# EAGLE design GAT8 PCB (EAGLE 6.1)

## Sheet 1 of 3
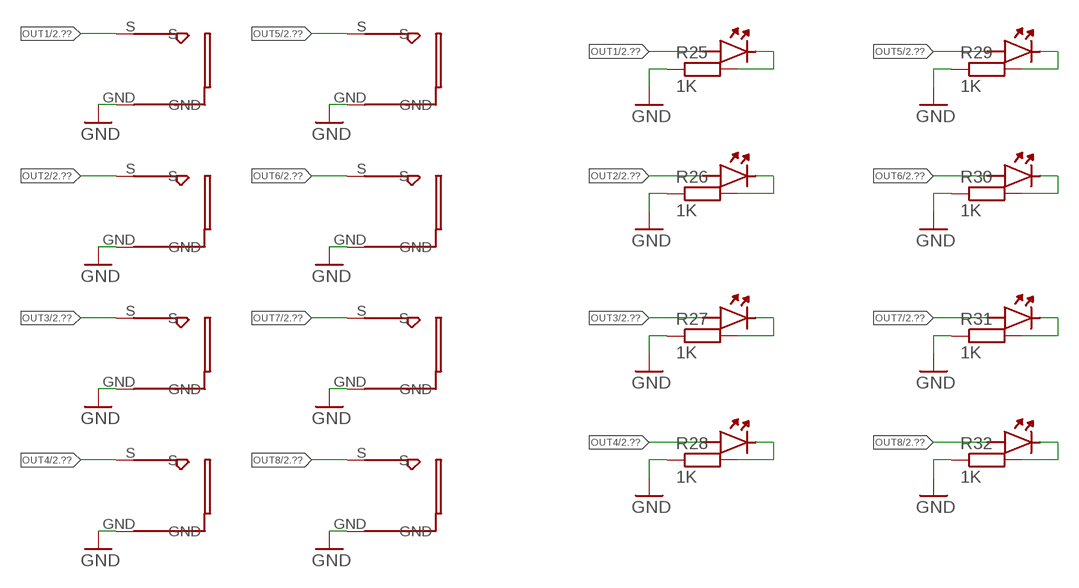
[diagram p0: schematic, sheet 1]

### Parts
LED8  LED  [LED]
OUT1  PJ302M  [PJ302M]
OUT2  PJ302M  [PJ302M]
OUT3  PJ302M  [PJ302M]
OUT4  PJ302M  [PJ302M]
OUT5  PJ302M  [PJ302M]
OUT6  PJ302M  [PJ302M]
OUT7  PJ302M  [PJ302M]
OUT8  PJ302M  [PJ302M]
R25  1K  R-EU_R1206  [R1206]
R26  1K  R-EU_R1206  [R1206]
R27  1K  R-EU_R1206  [R1206]
R28  1K  R-EU_R1206  [R1206]
R29  1K  R-EU_R1206  [R1206]
R30  1K  R-EU_R1206  [R1206]
R31  1K  R-EU_R1206  [R1206]
R32  1K  R-EU_R1206  [R1206]
U$1  LED  [LED]
U$2  LED  [LED]
U$3  LED  [LED]
U$4  LED  [LED]
U$5  LED  [LED]
U$6  LED  [LED]
U$7  LED  [LED]

### Nets
GND: OUT1.GND OUT2.GND OUT3.GND OUT4.GND OUT5.GND OUT6.GND OUT7.GND OUT8.GND R25.1 R26.1 R27.1 R28.1 R29.1 R30.1 R31.1 R32.1 ; also sheet 2,3
N$2: R26.2 U$2.GND
N$12: R25.2 U$1.GND
N$13: R27.2 U$3.GND
N$14: R28.2 U$4.GND
N$15: LED8.GND R32.2
N$16: R31.2 U$7.GND
N$17: R30.2 U$6.GND
N$18: R29.2 U$5.GND
OUT1: OUT1.S U$1.S ; also sheet 2
OUT2: OUT2.S U$2.S ; also sheet 2
OUT3: OUT3.S U$3.S ; also sheet 2
OUT4: OUT4.S U$4.S ; also sheet 2
OUT5: OUT5.S U$5.S ; also sheet 2
OUT6: OUT6.S U$6.S ; also sheet 2
OUT7: OUT7.S U$7.S ; also sheet 2
OUT8: LED8.S OUT8.S ; also sheet 2

## Sheet 2 of 3
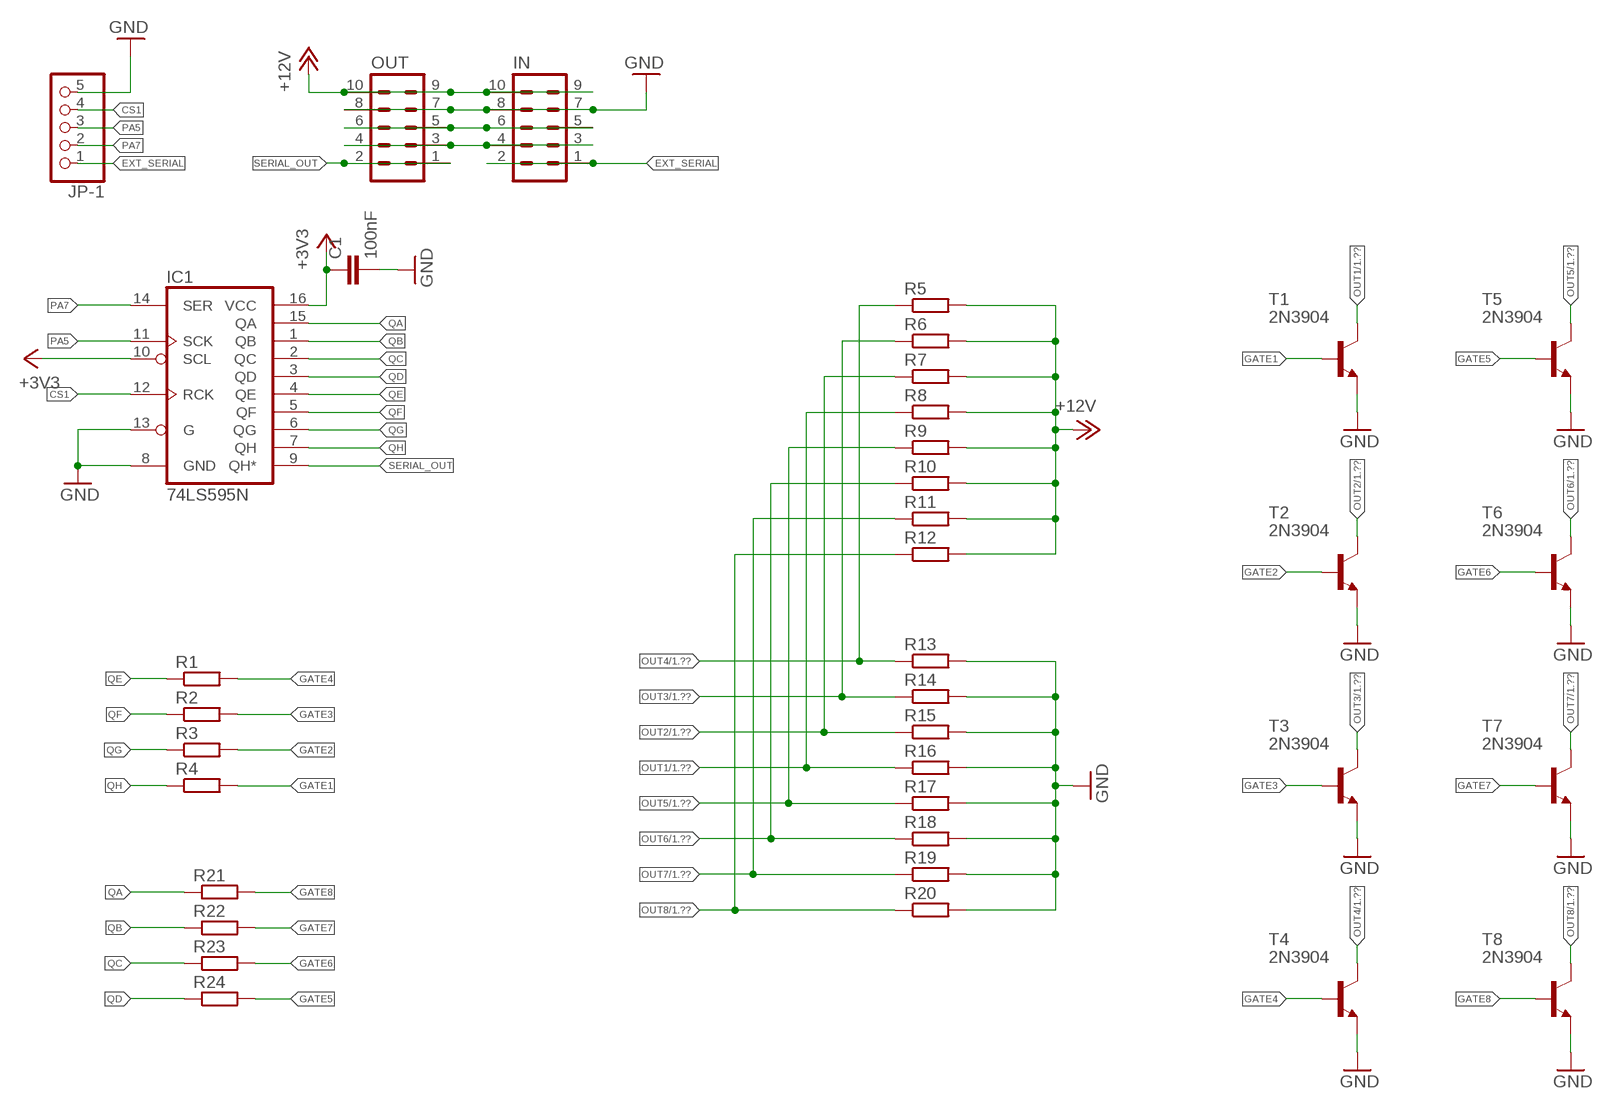
[diagram p1: schematic, sheet 2]

### Parts
C1  100nF  C-EUC1206K  [C1206K]
IC1  74LS595N  [DIL16]
IN  ML10  [ML10]
JP-1  PINHD-1X5_2.54  [1X05]
OUT  ML10  [ML10]
R1  R-EU_R1206  [R1206]
R2  R-EU_R1206  [R1206]
R3  R-EU_R1206  [R1206]
R4  R-EU_R1206  [R1206]
R5  R-EU_R1206  [R1206]
R6  R-EU_R1206  [R1206]
R7  R-EU_R1206  [R1206]
R8  R-EU_R1206  [R1206]
R9  R-EU_R1206  [R1206]
R10  R-EU_R1206  [R1206]
R11  R-EU_R1206  [R1206]
R12  R-EU_R1206  [R1206]
R13  R-EU_R1206  [R1206]
R14  R-EU_R1206  [R1206]
R15  R-EU_R1206  [R1206]
R16  R-EU_R1206  [R1206]
R17  R-EU_R1206  [R1206]
R18  R-EU_R1206  [R1206]
R19  R-EU_R1206  [R1206]
R20  R-EU_R1206  [R1206]
R21  R-EU_R1206  [R1206]
R22  R-EU_R1206  [R1206]
R23  R-EU_R1206  [R1206]
R24  R-EU_R1206  [R1206]
T1  2N3904  [TO92]
T2  2N3904  [TO92]
T3  2N3904  [TO92]
T4  2N3904  [TO92]
T5  2N3904  [TO92]
T6  2N3904  [TO92]
T7  2N3904  [TO92]
T8  2N3904  [TO92]

### Nets
+3V3: C1.1 IC1.10(SCL) IC1.16(VCC) ; also sheet 3
+12V: IN.9 IN.10 OUT.9 OUT.10 R5.2 R6.2 R7.2 R8.2 R9.2 R10.2 R11.2 R12.2 ; also sheet 3
CS1: IC1.12(RCK) JP-1.4
EXT_SERIAL: IN.1 IN.2 JP-1.1
GATE1: R4.2 T1.2(B)
GATE2: R3.2 T2.2(B)
GATE3: R2.2 T3.2(B)
GATE4: R1.2 T4.2(B)
GATE5: R24.2 T5.2(B)
GATE6: R23.2 T6.2(B)
GATE7: R22.2 T7.2(B)
GATE8: R21.2 T8.2(B)
GND: C1.2 IC1.8(GND) IC1.13(G) IN.7 IN.8 JP-1.5 OUT.7 OUT.8 R13.2 R14.2 R15.2 R16.2 R17.2 R18.2 R19.2 R20.2 T1.3(E) T2.3(E) T3.3(E) T4.3(E) T5.3(E) T6.3(E) T7.3(E) T8.3(E) ; also sheet 1,3
N$5: IN.3 IN.4 OUT.3 OUT.4
N$6: IN.5 IN.6 OUT.5 OUT.6
OUT1: R8.1 R16.1 T1.1(C) ; also sheet 1
OUT2: R7.1 R15.1 T2.1(C) ; also sheet 1
OUT3: R6.1 R14.1 T3.1(C) ; also sheet 1
OUT4: R5.1 R13.1 T4.1(C) ; also sheet 1
OUT5: R9.1 R17.1 T5.1(C) ; also sheet 1
OUT6: R10.1 R18.1 T6.1(C) ; also sheet 1
OUT7: R11.1 R19.1 T7.1(C) ; also sheet 1
OUT8: R12.1 R20.1 T8.1(C) ; also sheet 1
PA5: IC1.11(SCK) JP-1.3
PA7: IC1.14(SER) JP-1.2
QA: IC1.15(QA) R21.1
QB: IC1.1(QB) R22.1
QC: IC1.2(QC) R23.1
QD: IC1.3(QD) R24.1
QE: IC1.4(QE) R1.1
QF: IC1.5(QF) R2.1
QG: IC1.6(QG) R3.1
QH: IC1.7(QH) R4.1
SERIAL_OUT: IC1.9(QH*) OUT.1 OUT.2

## Sheet 3 of 3
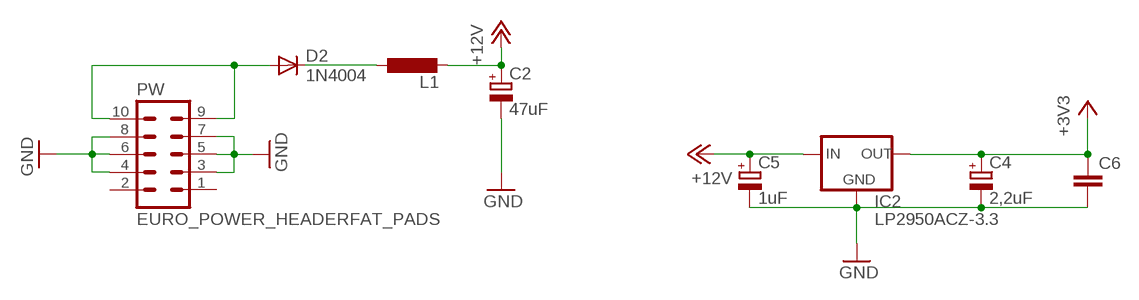
[diagram p2: schematic, sheet 3]

### Parts
C2  47uF  CPOL-EUE2-5  [E2-5]
C4  2,2uF  CPOL-EUE2-5  [E2-5]
C5  1uF  CPOL-EUE2-5  [E2-5]
C6  C-EUC1206K  [C1206K]
D2  1N4004  [DO41-10]
IC2  LP2950ACZ-3.3  [TO92]
L1  L-EU0207/10  [0207/10]
PW  EURO_POWER_HEADERFAT_PADS  [EURO_PWR_HEADER_FAT]

### Nets
+3V3: C4.+ C6.1 IC2.1(OUT) ; also sheet 2
+12V: C2.+ C5.+ IC2.3(IN) L1.2 ; also sheet 2
GND: C2.- C4.- C5.- C6.2 IC2.2(GND) PW.3 PW.4 PW.5 PW.6 PW.7 PW.8 ; also sheet 1,2
N$1: D2.A PW.9 PW.10
N$3: D2.C L1.1
Unconnected: PW.1 PW.2

## Library data of the parts
C1 C6 = resistor-mod:C-EU: CAPACITOR, European symbol
C2 C4 C5 = resistor-mod:CPOL-EU: POLARIZED CAPACITOR, European symbol
D2 = diode:1N4004: DIODE general purpose rectifier, 1 A
IC1 = SparkFun-DigitalIC:74*595: 8-bit SHIFT REGISTER, output latch
IC2 = v-reg:LP2950?*: Source: http://cache.national.com/ds/LP/LP2950.pdf
IN OUT = con-ml:ML10: HARTING; OC_FARNELL: unknown; OC_NEWARK: unknown
JP-1 = pinhead 2:PINHD-1X5: PIN HEADER
L1 = resistor-mod:L-EU: INDUCTOR, European symbol
LED8 U$1-U$7 = LED:LED
OUT1-OUT8 = PJ203M 3.5mm:PJ302M: Klinkenbuchse 3.5mm Thonk
PW = MusicThingModular mod:EURO_POWER_HEADER: Power Header 10 pin power header for Eurorack Power Supplies Variants with fatter pads for easier soldering, and the LOCK variant which has 5mil offset pins to hold the component in place before soldering
R1-R32 = resistor-mod:R-EU_: RESISTOR, European symbol
T1-T8 = transistor:2N3904: NPN TRANSISTOR

## Board
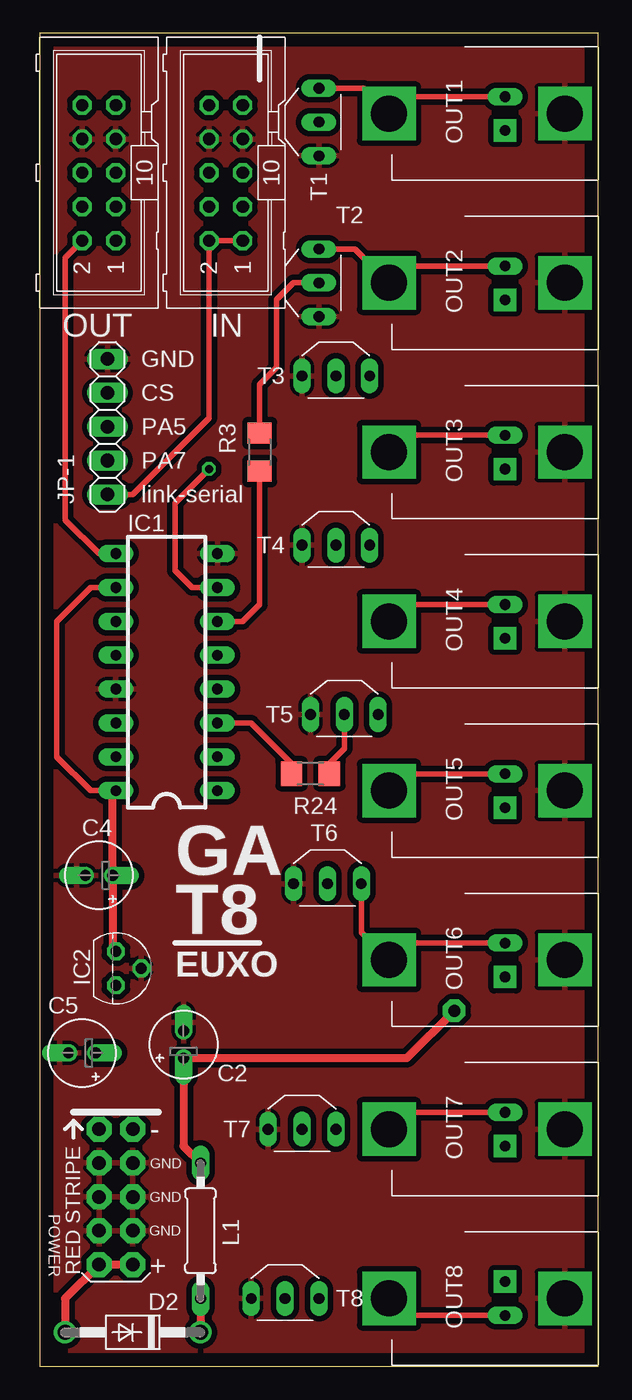
[diagram p3: board, top side]
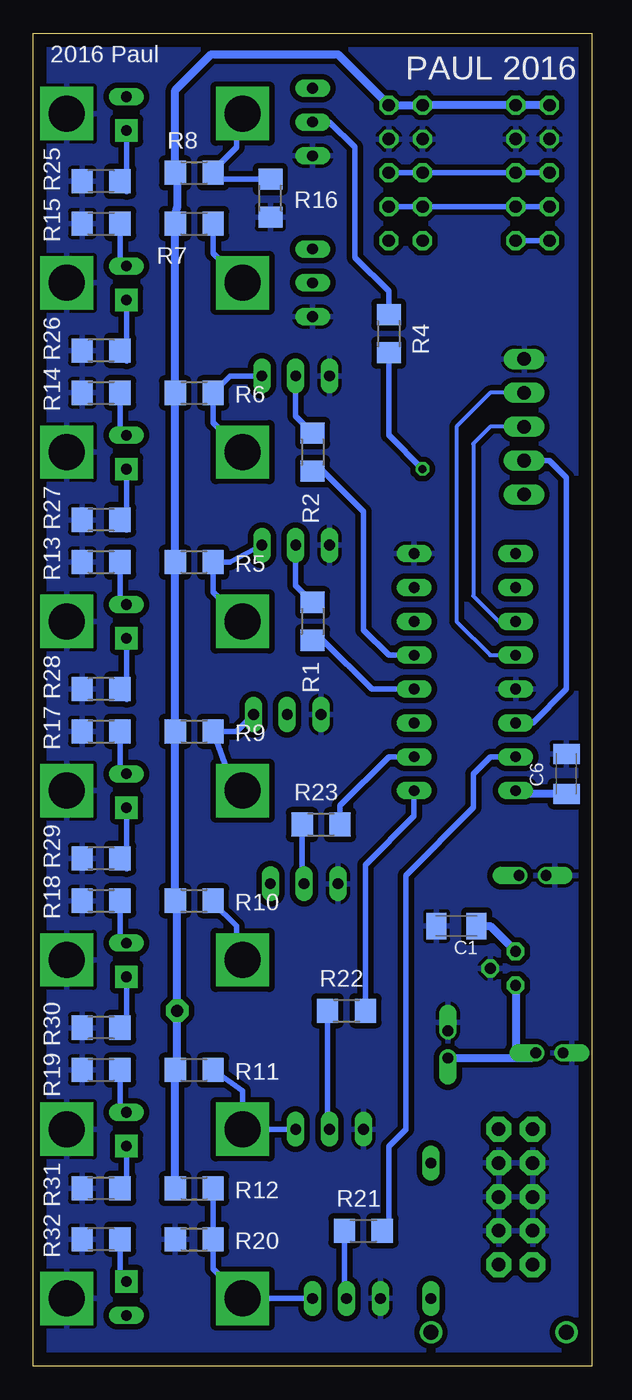
[diagram p4: board, bottom side, seen from below]

Size 41.92 x 100 mm. Coordinates in mm from the lower left corner, seen from the top.
Outline: 0,0 41.92,0 41.92,100 0,100 0,0
Copper layers (1*16): Top 0.035mm / dielectric 1.5mm / Bottom 0.035mm
Design rules: minimum track width 10mil, minimum drill 24mil, track to track 8mil, track to pad 8mil, pad to pad 8mil, via to via 8mil, smd to smd 8mil, copper to edge 40mil, drill to drill 8mil, minimum pad ring 10mil, minimum via ring 8mil, stop-mask expansion 4mil, vias tented up to drill 0mil, thermal gap 10mil

### Footprints (pad centres in the part's own frame; a part is rotated, then mirrored left to right if it is on the bottom)
C1206K = smd 1.5 x 2: 1 -1.5,0; 2 1.5,0
E2-5 = drill 0.813 pad 1.27 offset: + -1.016,0; - 1.016,0
DO41-10 = drill 1.118: A 5.08,0; C -5.08,0
DIL16 = drill 0.813 long: 1 -8.89,-3.81; 2 -6.35,-3.81; 3 -3.81,-3.81; 4 -1.27,-3.81; 5 1.27,-3.81; 6 3.81,-3.81; 7 6.35,-3.81; 8 8.89,-3.81; 9 8.89,3.81; 10 6.35,3.81; 11 3.81,3.81; 12 1.27,3.81; 13 -1.27,3.81; 14 -3.81,3.81; 15 -6.35,3.81; 16 -8.89,3.81
TO92 = drill 0.813 octagon: 1 -1.27,0; 2 0,1.905; 3 1.27,0
ML10 = drill 0.914 octagon: 1 -5.08,-1.27; 2 -5.08,1.27; 3 -2.54,-1.27; 4 -2.54,1.27; 5 0,-1.27; 6 0,1.27; 7 2.54,-1.27; 8 2.54,1.27; 9 5.08,-1.27; 10 5.08,1.27
1X05 = drill 1.016 long: 1 -5.08,0; 2 -2.54,0; 3 0,0; 4 2.54,0; 5 5.08,0
0207/10 = drill 0.813 long: 1 -5.08,0; 2 5.08,0
LED = drill 0.8 pad 1.676 square: GND 0,1.27 | drill 0.8 pad 1.27 long: S 0,-1.27
PJ302M = drill 2.7 pad 4 square: GND 2.5,0; S 15.7,0
EURO_PWR_HEADER_FAT = drill 1.016 pad 1.88 octagon: 1 -5.08,-1.27; 2 -5.08,1.27; 3 -2.54,-1.27; 4 -2.54,1.27; 5 0,-1.27; 6 0,1.27; 7 2.54,-1.27; 8 2.54,1.27; 9 5.08,-1.27; 10 5.08,1.27
R1206 = smd 1.6 x 1.803: 1 -1.422,0; 2 1.422,0
TO92' = drill 0.813 long: 1 2.54,0; 2 0,0; 3 -2.54,0

### Placement (x,y rotation side)
C1  10.16,33.02 180 bottom
C2  10.79,24.13 90 top
C4  4.45,36.83 180 top
C5  3.18,23.5 180 top
C6  1.91,44.45 90 bottom
D2  6.98,2.54 180 top
IC1  9.53,52.07 90 top
IC2  5.71,29.84 270 top
IN  13.97,89.53 90 top
JP-1  5.08,70.48 90 top
L1  12.06,10.16 90 top
LED8  34.93,5.08 0 bottom
OUT  4.45,89.53 90 top
OUT1  41.92,93.98 180 top
OUT2  41.92,81.28 180 top
OUT3  41.92,68.58 180 top
OUT4  41.92,55.88 180 top
OUT5  41.92,43.18 180 top
OUT6  41.92,30.48 180 top
OUT7  41.92,17.78 180 top
OUT8  41.92,5.08 180 top
PW  5.71,12.7 270 top
R1  20.95,55.88 90 bottom
R2  20.95,68.58 90 bottom
R3  16.51,68.58 90 top
R4  15.24,77.47 90 bottom
R5  29.84,60.33 180 bottom
R6  29.84,73.03 180 bottom
R7  29.84,85.72 180 bottom
R8  29.84,89.53 180 bottom
R9  29.84,47.62 180 bottom
R10  29.84,34.92 180 bottom
R11  29.84,22.23 180 bottom
R12  29.84,13.34 180 bottom
R13  36.83,60.33 180 bottom
R14  36.83,73.03 180 bottom
R15  36.83,85.72 180 bottom
R16  24.13,87.63 270 bottom
R17  36.83,47.62 180 bottom
R18  36.83,34.92 180 bottom
R19  36.83,22.23 180 bottom
R20  29.84,9.53 180 bottom
R21  17.15,10.16 180 bottom
R22  18.41,26.67 180 bottom
R23  20.32,40.64 180 bottom
R24  20.32,44.45 0 top
R25  36.83,88.9 0 bottom
R26  36.83,76.2 0 bottom
R27  36.83,63.5 0 bottom
R28  36.83,50.8 0 bottom
R29  36.83,38.1 0 bottom
R30  36.83,25.4 0 bottom
R31  36.83,13.34 0 bottom
R32  36.83,9.53 0 bottom
T1  2N3904  [TO92']  20.95,93.34 90 top
T2  2N3904  [TO92']  20.95,81.28 90 top
T3  2N3904  [TO92']  22.23,74.3 0 top
T4  2N3904  [TO92']  22.23,61.59 0 top
T5  2N3904  [TO92']  22.86,48.9 0 top
T6  2N3904  [TO92']  21.59,36.2 0 top
T7  2N3904  [TO92']  19.69,17.78 0 top
T8  2N3904  [TO92']  18.41,5.08 0 top
U$1  34.93,93.98 180 bottom
U$2  34.93,81.28 180 bottom
U$3  34.93,68.58 180 bottom
U$4  34.93,55.88 180 bottom
U$5  34.93,43.18 180 bottom
U$6  34.93,30.48 180 bottom
U$7  34.93,17.78 180 bottom

### Tracks (layer width: path | path; a pad name or v marks a point on that pad's centre or on a via)
+3V3
  Top 0.406: IC1.16 3.81,43.18 1.27,45.72 1.27,55.88 3.81,58.42 IC1.10
  Top 0.61: IC2.1 5.46,31.37 C4.+ 5.46,42.93 IC1.16
  Bottom 0.61: C1.1 7.62,33.02 IC2.1 | C6.1 5.48,42.95 IC1.16
+12V  (via drill 0.9 pad 1.68)
  Top 0.61: L1.2 10.79,16.51 C2.+ 27.56,23.11 v31.12,26.67
  Bottom 0.61: R12.2 31.27,22.07 31.12,22.23 | 31.12,22.23 R11.2 | 31.12,22.23 v31.12,26.67 31.12,34.77 R10.2 R9.2 R5.2 R6.2 R7.2 31.27,86.51 31.12,87 31.12,89.53 R8.2 31.27,95.73 28.58,98.42 19.05,98.42 IN.9 IN.10 OUT.9 OUT.10 | C2.+ 4.57,23.11 C5.+ 5.71,23.5 IC2.3
CS1
  Bottom 0.305: JP-1.4 7.62,73.03 10.16,70.48 10.16,55.88 7.62,53.34 IC1.12
EXT_SERIAL
  Top 0.406: JP-1.1 6.98,65.41 12.7,71.12 IN.2 IN.1
GATE1
  Bottom 0.406: T1.2 19.69,93.34 17.78,91.44 17.78,83.19 15.24,80.64 R4.2 15.24,79.38
GATE2
  Top 0.406: R3.2 16.51,73.66 17.78,74.93 17.78,80.01 19.05,81.28 T2.2
GATE3
  Bottom 0.406: T3.2 22.23,71.27 R2.2
GATE4
  Bottom 0.406: T4.2 22.23,58.57 R1.2
GATE5
  Top 0.406: R24.2 21.74,45.24 22.86,46.35 T5.2
GATE6
  Bottom 0.406: R23.2 21.74,36.35 T6.2
GATE7
  Bottom 0.406: R22.2 19.84,17.93 T7.2
GATE8
  Bottom 0.406: R21.2 18.57,5.23 T8.2
GND
  pour Bottom (isolate 0.406): 0,99.69 0,0 41.91,0 41.91,99.69
  pour Top (isolate 0.406): 0,99.69 0,0 41.91,0 41.91,99.69
N$1
  Top 0.61: D2.A 1.91,5.08 PW.9 PW.10
N$2
  Bottom 0.406: U$2.GND 34.93,75.41 R26.2
N$3
  Top 0.61: L1.1 D2.C
N$5
  Bottom 0.406: OUT.4 OUT.3 IN.4 IN.3
N$6
  Bottom 0.406: IN.5 IN.6 OUT.5 OUT.6
N$12
  Bottom 0.406: U$1.GND 34.93,88.11 R25.2
N$13
  Bottom 0.406: U$3.GND 34.93,62.71 R27.2
N$14
  Bottom 0.406: U$4.GND 34.93,50.01 R28.2
N$15
  Bottom 0.406: R32.2 35.41,6.83 LED8.GND
N$16
  Bottom 0.406: U$7.GND 34.93,13.82 R31.2
N$17
  Bottom 0.406: U$6.GND 34.93,25.88 R30.2
N$18
  Bottom 0.406: U$5.GND 34.93,37.31 R29.2
OUT1
  Top 0.406: U$1.S 27.48,95.25 OUT1.S 24.3,95.89 T1.1
  Bottom 0.406: OUT1.S 26.67,93.52 26.67,91.44 28.42,89.69 R8.1 27.94,89.05 R16.1
OUT2
  Top 0.406: T2.1 23.67,83.82 OUT2.S 27.48,82.55 U$2.S
  Bottom 0.406: R15.1 35.41,83.03 U$2.S | R7.1 28.42,83.49 OUT2.S
OUT3
  Top 0.406: OUT3.S 26.67,68.58 27.94,69.85 U$3.S
  Bottom 0.406: R14.1 35.41,70.33 U$3.S | OUT3.S 28.42,70.79 R6.1 27.15,74.3 T3.1
OUT4
  Top 0.406: U$4.S 27.48,57.15 OUT4.S
  Bottom 0.406: R13.1 35.41,57.63 U$4.S | OUT4.S 28.42,58.09 R5.1 27.15,60.33 T4.1
OUT5
  Top 0.406: U$5.S 27.48,44.45 OUT5.S
  Bottom 0.406: OUT5.S 27.15,44.12 R9.1 26.67,47.62 T5.1 | R17.1 35.41,44.93 U$5.S
OUT6
  Top 0.406: U$6.S 27.48,31.75 OUT6.S 24.13,32.56 T6.1
  Bottom 0.406: R18.1 35.41,32.23 U$6.S | R10.1 28.42,34.77 26.67,33.02 26.67,31.11 26.03,30.48 OUT6.S
OUT7
  Top 0.406: U$7.S 27.48,19.05 OUT7.S
  Bottom 0.406: R11.1 26.21,20.65 OUT7.S T7.1 | R19.1 35.41,19.53 U$7.S
OUT8
  Top 0.406: LED8.S 27.48,3.81 OUT8.S
  Bottom 0.406: R12.1 R20.1 28.42,7.29 OUT8.S T8.1
PA5
  Bottom 0.305: JP-1.3 7.62,70.48 8.89,69.22 8.89,57.78 6.98,55.88 IC1.11
PA7
  Bottom 0.406: IC1.14 4.45,48.26 1.91,50.8 1.91,66.67 3.18,67.94 JP-1.2
QA
  Bottom 0.406: IC1.15 7.62,45.72 8.89,44.45 8.89,41.91 13.97,36.83 13.97,17.78 15.24,16.51 15.24,10.64 R21.1
QB
  Bottom 0.406: R22.1 16.99,37.62 13.33,41.27 IC1.1
QC
  Bottom 0.406: R23.1 18.9,42.06 15.24,45.72 IC1.2
QD
  Top 0.406: IC1.3 15.87,48.26 19.05,45.09 18.9,44.93 R24.1
QE
  Bottom 0.406: R1.1 20.17,54.46 16.51,50.8 IC1.4
QF
  Bottom 0.406: IC1.5 15.24,53.34 17.15,55.24 17.15,64.14 20.17,67.16 R2.1
QG
  Top 0.406: R3.1 16.51,57.15 15.24,55.88 IC1.6
QH  (via drill 0.6)
  Top 0.406: IC1.7 11.43,58.42 10.16,59.69 10.16,64.77 v12.7,67.31
  Bottom 0.406: R4.1 15.24,69.85 v12.7,67.31
SERIAL_OUT
  Top 0.406: OUT.2 1.91,83.19 1.91,63.5 4.45,60.96 IC1.9
  Bottom 0.406: OUT.2 OUT.1

### Text on the board
tPlace: GND | CS | PA5 | PA7 | link-serial
tNames: GA | T8 | EUXO
bNames: 2016 Paul | PAUL 2016